# EAGLE schematic mech-control-SCH-v0.2 (EAGLE 9.7.0)
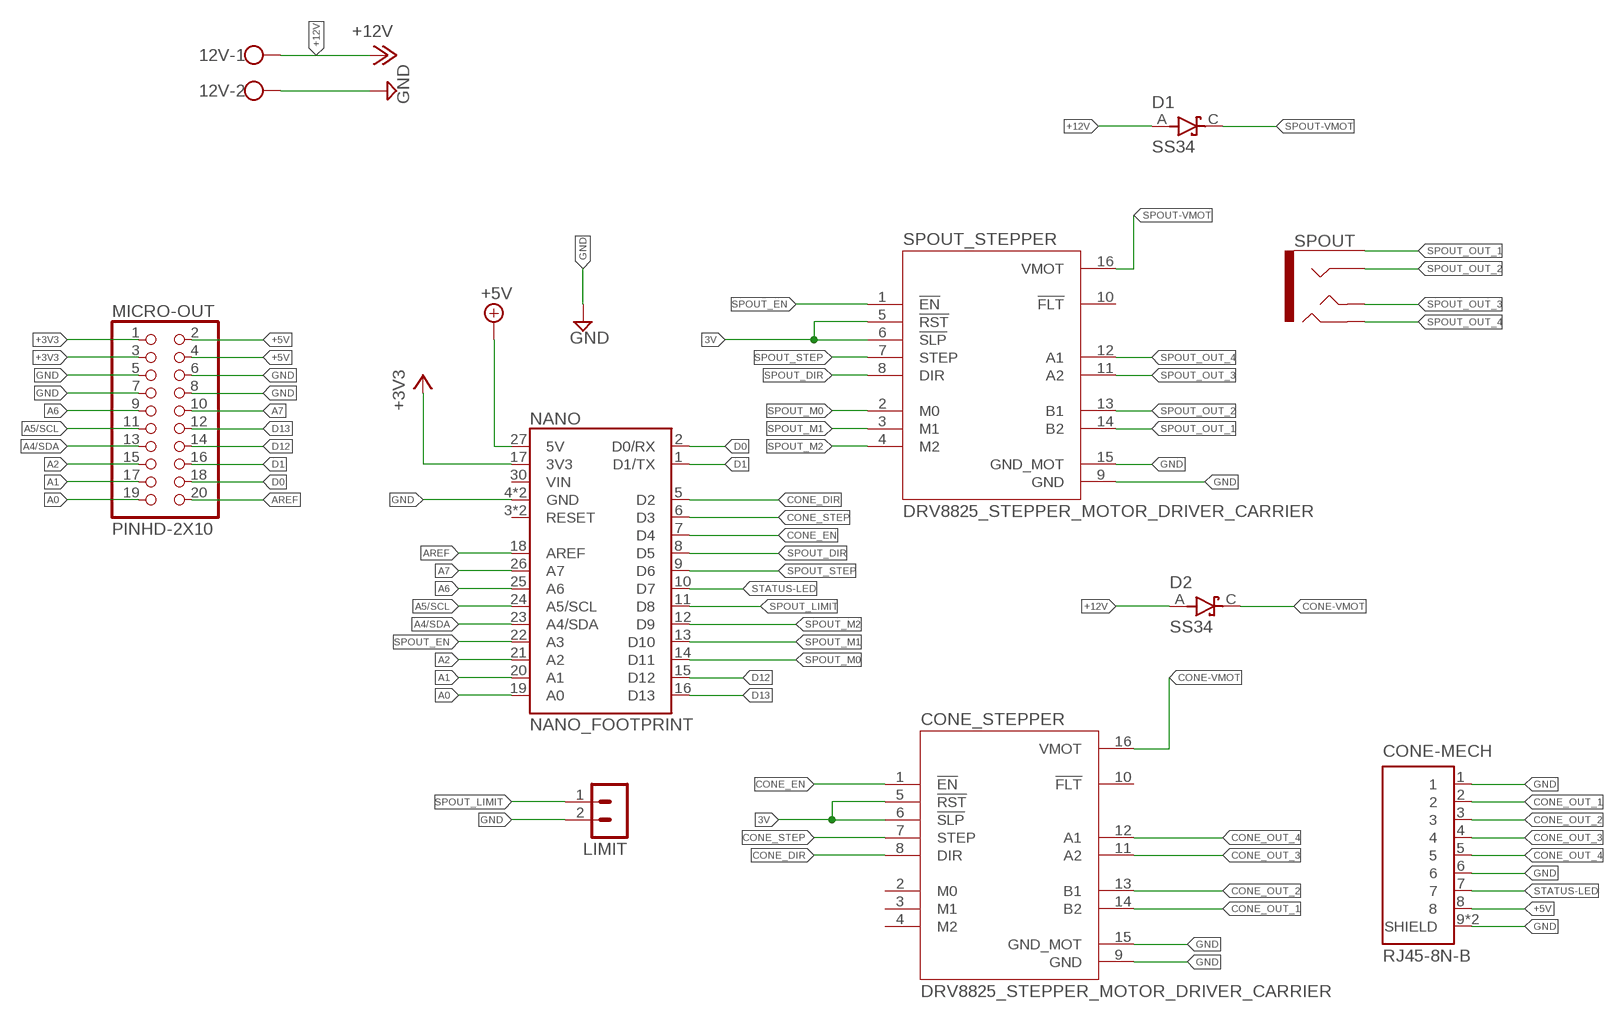
[diagram p0: schematic, sheet 1]

## Parts
12V  W237-102  [W237-102]
CONE-MECH  RJ45-8N-B  [TE_RJ45-8N-B]
CONE_STEPPER  DRV8825_STEPPER_MOTOR_DRIVER_CARRIER  [IC_DRV8825_STEPPER_MOTOR_DRIVER_CARRIER]
D1  SS34  [DIOM7959X265N]
D2  SS34  [DIOM7959X265N]
LIMIT  B2B-XH-2  [B2B-XH-A]
MICRO-OUT  PINHD-2X10  [2X10]
NANO  NANO_FOOTPRINT  [NANO]
SPOUT  AUDIO_JACK_TRRSSMD_RA  [AUDIO_JACK_3.5MM_TRRS_SMD_RA]
SPOUT_STEPPER  DRV8825_STEPPER_MOTOR_DRIVER_CARRIER  [IC_DRV8825_STEPPER_MOTOR_DRIVER_CARRIER]

## Nets
3V: CONE_STEPPER.5(!RST) CONE_STEPPER.6(!SLP) SPOUT_STEPPER.5(!RST) SPOUT_STEPPER.6(!SLP)
+3V3: MICRO-OUT.1 MICRO-OUT.3 NANO.17(3V3)
+5V: CONE-MECH.8 MICRO-OUT.2 MICRO-OUT.4 NANO.27(5V)
+12V: 12V.1 D1.A D2.A
A0: MICRO-OUT.19 NANO.19(A0)
A1: MICRO-OUT.17 NANO.20(A1)
A2: MICRO-OUT.15 NANO.21(A2)
A4/SDA: MICRO-OUT.13 NANO.23(A4/SDA)
A5/SCL: MICRO-OUT.11 NANO.24(A5/SCL)
A6: MICRO-OUT.9 NANO.25(A6)
A7: MICRO-OUT.10 NANO.26(A7)
AREF: MICRO-OUT.20 NANO.18(AREF)
CONE-VMOT: CONE_STEPPER.16(VMOT) D2.C(K)
CONE_DIR: CONE_STEPPER.8(DIR) NANO.5(D2)
CONE_EN: CONE_STEPPER.1(!EN) NANO.7(D4)
CONE_OUT_1: CONE-MECH.2 CONE_STEPPER.14(B2)
CONE_OUT_2: CONE-MECH.3 CONE_STEPPER.13(B1)
CONE_OUT_3: CONE-MECH.4 CONE_STEPPER.11(A2)
CONE_OUT_4: CONE-MECH.5 CONE_STEPPER.12(A1)
CONE_STEP: CONE_STEPPER.7(STEP) NANO.6(D3)
D0: MICRO-OUT.18 NANO.2(D0/RX)
D1: MICRO-OUT.16 NANO.1(D1/TX)
D12: MICRO-OUT.14 NANO.15(D12)
D13: MICRO-OUT.12 NANO.16(D13)
GND: 12V.2 CONE-MECH.1 CONE-MECH.6 CONE-MECH.9(SHIELD) CONE-MECH.10(SHIELD) CONE_STEPPER.9(GND) CONE_STEPPER.15(GND_MOT) LIMIT.2 MICRO-OUT.5 MICRO-OUT.6 MICRO-OUT.7 MICRO-OUT.8 NANO.4(GND) NANO.29(GND) SPOUT_STEPPER.9(GND) SPOUT_STEPPER.15(GND_MOT)
SPOUT-VMOT: D1.C(K) SPOUT_STEPPER.16(VMOT)
SPOUT_DIR: NANO.8(D5) SPOUT_STEPPER.8(DIR)
SPOUT_EN: NANO.22(A3) SPOUT_STEPPER.1(!EN)
SPOUT_LIMIT: LIMIT.1 NANO.11(D8)
SPOUT_M0: NANO.14(D11) SPOUT_STEPPER.2(M0)
SPOUT_M1: NANO.13(D10) SPOUT_STEPPER.3(M1)
SPOUT_M2: NANO.12(D9) SPOUT_STEPPER.4(M2)
SPOUT_OUT_1: SPOUT.EARTH SPOUT_STEPPER.14(B2)
SPOUT_OUT_2: SPOUT.RING1 SPOUT_STEPPER.13(B1)
SPOUT_OUT_3: SPOUT.TIP SPOUT_STEPPER.11(A2)
SPOUT_OUT_4: SPOUT.RING2 SPOUT_STEPPER.12(A1)
SPOUT_STEP: NANO.9(D6) SPOUT_STEPPER.7(STEP)
STATUS-LED: CONE-MECH.7 NANO.10(D7)
Unconnected: CONE_STEPPER.2(M0) CONE_STEPPER.3(M1) CONE_STEPPER.4(M2) CONE_STEPPER.10(!FLT) NANO.3(RESET) NANO.28(RESET) NANO.30(VIN) SPOUT_STEPPER.10(!FLT)

## Library data of the parts
12V = con-wago-500:W237-102: WAGO SCREW CLAMP; MPN: 237-102; OC_FARNELL: unknown; OC_NEWARK: 70K9898
CONE-MECH = mos-rj45:RJ45-8N-B: RJ Jack / Signal Line EMI/RFI Filters 6 TERM LOW PROFILE BLOCK INDUCTOR 8 PIN Check availability <https://pricing.snapeda.com/parts/RJ45-8N-B/TE%20Connectivity/view-part?ref=eda>; AVAILABILITY: In Stock; CHECK_PRICES: https://www.snapeda.com/parts/RJ45-8N-B/TE+Connectivity+Corcom+Filters/view-part/?ref=eda; DESCRIPTION: Corcom FILTER SIGNAL LINE MODULAR 8CONTACTS 1 PORT THROUGH HOLE | TE Connectivity RJ45-8N-B; MF: TE Connectivity; MP: RJ45-8N-B; PACKAGE: None; PRICE: None; PURCHASE-URL: https://www.snapeda.com/api/url_track_click_mouser/?unipart_id=49386&manufacturer=TE Connectivity&part_name=RJ45-8N-B&search_term=None; SNAPEDA_LINK: https://www.snapeda.com/parts/RJ45-8N-B/TE+Connectivity+Corcom+Filters/view-part/?ref=snap
CONE_STEPPER SPOUT_STEPPER = DRV8825_STEPPER_MOTOR_DRIVER_CARRIER:DRV8825_STEPPER_MOTOR_DRIVER_CARRIER: Stepper motor controler; IC: DRV8825; 1.5A; Uin mot: 8.2÷45V; AVAILABILITY: Unavailable; DESCRIPTION: Stepper, Bipolar 8.2 ~ 45VDC Supply 1.5A 8.2 ~ 45V Load; MF: Pololu; MP: DRV8825 STEPPER MOTOR DRIVER CARRIER; PACKAGE: None; PRICE: None
D1 D2 = SS34:SS34: Diode Schottky 40V 3A 2-Pin SMC T/R Check availability <https://pricing.snapeda.com/parts/SS34/ON%20Semiconductor/view-part?ref=eda>; AVAILABILITY: In Stock; CHECK_PRICES: https://www.snapeda.com/parts/SS34/Onsemi/view-part/?ref=eda; DESCRIPTION: Diode Schottky 40 V 3A Surface Mount SMC (DO-214AB); MF: ON Semiconductor; MP: SS34; PACKAGE: SMC-2 ON Semiconductor; PRICE: None; SNAPEDA_LINK: https://www.snapeda.com/parts/SS34/Onsemi/view-part/?ref=snap
LIMIT = con-JST XH:B2B-XH: JST XH series header 2.50mm pitch disconnectable crimp style connectors, vertical (side entry type), 2 pins
MICRO-OUT = Connector:PINHD-2X10: PIN HEADER; CATEGORY: Headers; DESCRIPTION: Header, Straight, 2x10 Position; MANUFACTURER: Generic; MPN: Generic; OPERATING_TEMPERATURE: Generic; PART_STATUS: Active; PITCH: 0.100" (2.54mm); ROHS_COMPLIANCE: Generic; SERIES: Generic; SUB-CATEGORY: Headers, Male Pins; TYPE: Board to Board or Cable, Unshrouded, Through Hole, Straight
NANO = SparkFun-Boards:NANO_FOOTPRINT: Generic Nano Footprint
SPOUT = SparkFun-Connectors:AUDIO_JACK_TRRS: Audio Jack - 3.5mm TRRS (SMD) This is a 3.5mm TRRS SMD audio jack. TRRS connectors are the audio-style connectors that you see on some phones, MP3 players and development boards. TRRS stands for “tip, ring, ring, sleeve,” which reflects that this has three conductors and a ground. SparkFun Products: Audio Jack <https://www.sparkfun.com/products/12639> mbed Starter Kit <https://www.sparkfun.com/products/12968> SparkFun TRRS 3.5mm Jack Breakout <https://www.sparkfun.com/products/11570>; PROD_ID: CONN-10676; SF_ID: PRT-12639